# EAGLE design main (EAGLE 8.3.1)
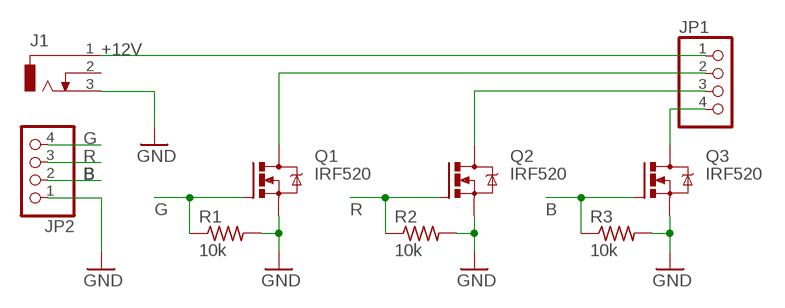
[diagram p0: schematic, sheet 1]

## Parts
J1  DCJ0303  [DCJ0303]
JP1  PINHD-1X4  [1X04]
JP2  PINHD-1X4  [1X04]
Q1  IRF520  [TO220BV]
Q2  IRF520  [TO220BV]
Q3  IRF520  [TO220BV]
R1  10k  R-US_0207/7  [0207/7]
R2  10k  R-US_0207/7  [0207/7]
R3  10k  R-US_0207/7  [0207/7]

## Nets
+12V: J1.1 JP1.1
B: JP2.2 Q3.G R3.1
G: JP2.4 Q1.G R1.1
GND: J1.3 JP2.1 Q1.S Q2.S Q3.S R1.2 R2.2 R3.2
N$1: JP1.4 Q3.D
N$2: JP1.3 Q2.D
N$3: JP1.2 Q1.D
R: JP2.3 Q2.G R2.1
Unconnected: J1.2

## Library data of the parts
J1 = con-jack:DCJ0303: DC POWER JACK Source: DCJ0303.pdf; OC_FARNELL: unknown; OC_NEWARK: unknown
JP1 JP2 = pinhead:PINHD-1X4: PIN HEADER
Q1-Q3 = transistor-power:IRF520: HEXFET Power MOSFET
R1-R3 = rcl:R-US_: RESISTOR, American symbol

## Board
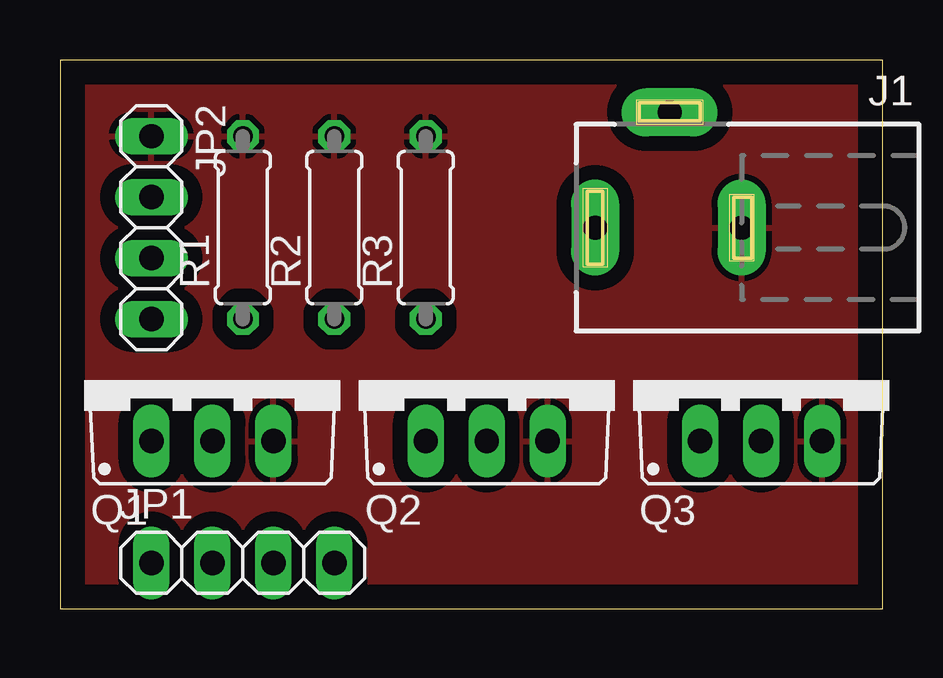
[diagram p1: board, top side]
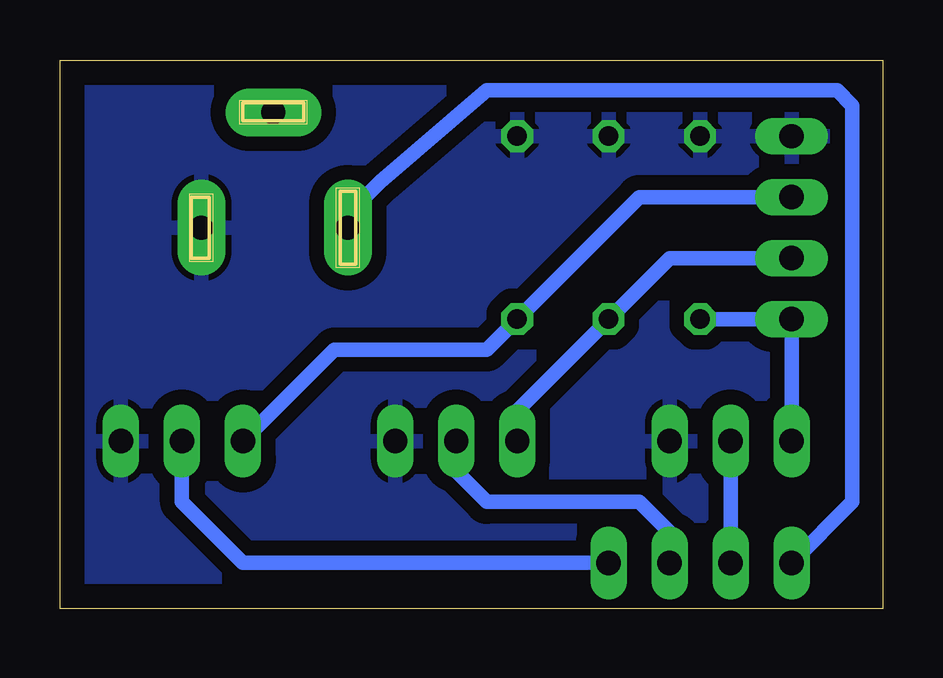
[diagram p2: board, bottom side, seen from below]

Size 34.29 x 22.86 mm. Coordinates in mm from the lower left corner, seen from the top.
Outline: 0,0 34.29,0 34.29,22.86 0,22.86 0,0
Copper layers (1*16): Top 0.035mm / dielectric 1.5mm / Bottom 0.035mm
Design rules "default *": minimum track width 12mil, minimum drill 0.35mm, track to track 24mil, track to pad 24mil, pad to pad 24mil, via to via 24mil, smd to smd 6mil, copper to edge 40mil, drill to drill 6mil, minimum pad ring 10mil, minimum via ring 8mil, stop-mask expansion 4mil, vias tented up to drill 0mil, thermal gap 10mil
Milling: area 22,14.4 to 22.6,17.4; area 28.1,14.6 to 28.8,17.1; area 24.1,20.3 to 26.7,21.1

### Footprints (pad centres in the part's own frame; a part is rotated, then mirrored left to right if it is on the bottom)
DCJ0303 = drill 1 pad 2 long: 1 0,3.1; 2 4.8,0; 3 0,-3
1X04 = drill 1.016 long: 1 -3.81,0; 2 -1.27,0; 3 1.27,0; 4 3.81,0
TO220BV = drill 1.016 long: D 0,-2.54; G -2.54,-2.54; S 2.54,-2.54
0207/7 = drill 0.813 octagon: 1 -3.81,0; 2 3.81,0

### Placement (x,y rotation side)
J1  25.4,15.88 90 top
JP1  7.62,1.91 0 top
JP2  3.81,15.88 270 top
Q1  6.35,9.52 0 top
Q2  17.78,9.52 0 top
Q3  29.21,9.52 0 top
R1  7.62,15.88 90 top
R2  11.43,15.88 90 top
R3  15.24,15.88 90 top

### Tracks (layer width: path | path; a pad name or v marks a point on that pad's centre or on a via)
+12V
  Bottom 0.61: JP1.1 1.27,4.45 1.27,20.95 1.9,21.59 16.51,21.59 20.95,17.78 22.3,16.44 J1.1
B
  Bottom 0.61: JP2.2 10.16,17.14 R3.1 16.51,10.8 22.86,10.8 Q3.G
G
  Bottom 0.61: R1.1 JP2.4 Q1.G
GND
  pour Bottom: 0,22.86 0,0 34.29,0 34.29,22.86
  pour Top: 0,22.86 0,0 34.29,0 34.29,22.86
N$1
  Bottom 0.61: JP1.4 26.67,1.91 29.21,4.45 Q3.D
N$2
  Bottom 0.61: JP1.3 8.89,3.17 10.16,4.45 16.51,4.45 17.78,5.71 Q2.D
N$3
  Bottom 0.61: JP1.2 Q1.D
R
  Bottom 0.61: Q2.G 15.24,8.25 R2.1 8.89,14.6 JP2.3